# Altium project zynq_bottomPCB.PrjPcb
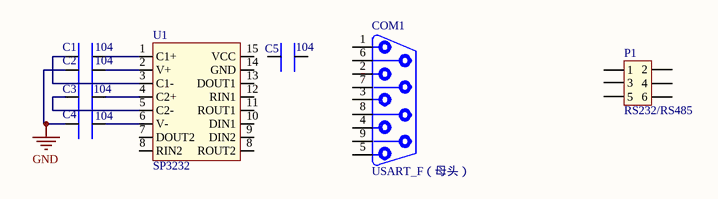
[diagram p0: zynq_bottom.SchDoc]
1 sheet, 8 parts. Net scope: global (net labels, ports and power ports of the same name join across sheets).
Board file: zynq_bottomPCB.PcbDoc

## Sheet zynq_bottom.SchDoc
size A4

### Parts
C1  104  [0603C]
C2  104  [0603C]
C3  104  [0603C]
C4  104  [0603C]
C5  104  [0603C]
COM1  USART_F（母头）  [DB9/S_A]
P1  RS232/RS485  [HDR2.54-LI-2x3P]
U1  SP3232  [TSSOP16]

### Nets
GND: C2.1 C4.1
NetC1_1: C1.1 U1.3(C1-)
NetC1_2: C1.2 U1.1(C1+)
NetC2_2: C2.2 U1.2(V+)
NetC3_1: C3.1 U1.5(C2-)
NetC3_2: C3.2 U1.4(C2+)
NetC4_2: C4.2 U1.6(V-)

Not connected (* = marked no-connect by the designer): C5 1 2; COM1 1 2 3 4 5 6 7 8 9; P1 1 2 3 4 5 6; U1 7(DOUT2) 8(RIN2) 9(DIN2) 10(DIN1) 11(ROUT1) 12(RIN1) 13(DOUT1) 14(GND) 15(VCC)

### Library data of the parts
C1-C5 = 0603C_104
U1 = SP3232: TSSOP16